# EAGLE design mic4830_proto (EAGLE 5.11)
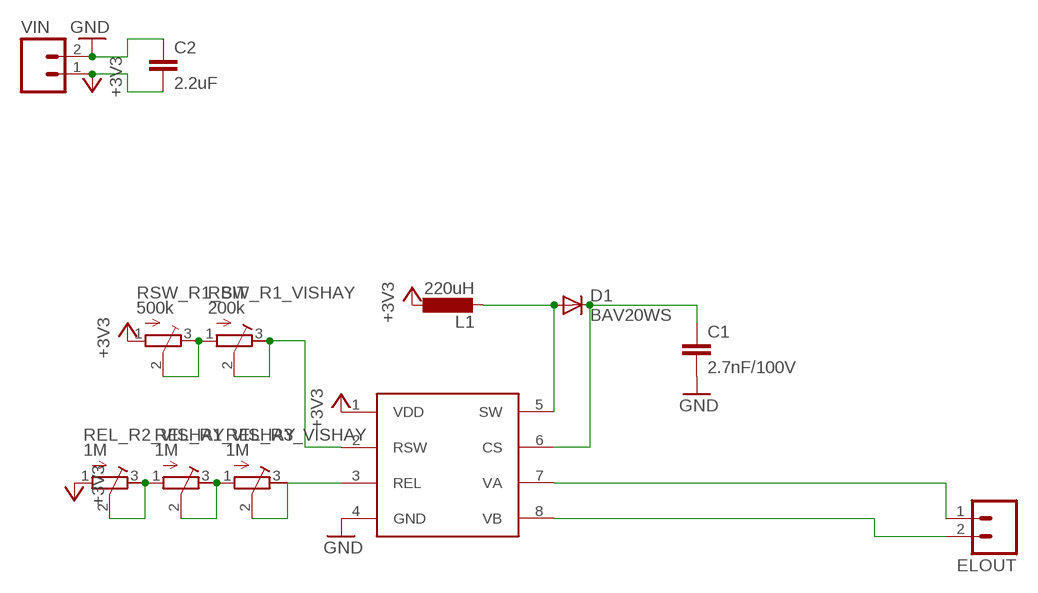
[diagram p0: schematic, sheet 1]

## Parts
C1  2.7nF/100V  C-EUC1210  [C1210]
C2  2.2uF  C-EUC0805K  [C0805K]
D1  BAV20WS  DIODESOD  [SOD-323]
ELOUT  M02PTH  [1X02]
L1  220uH  L-EUL1812  [L1812]
REL_R1_VISHAY  1M  R-TRIMMTSM53YL  [RTRIMTSM53YL]
REL_R2_VISHAY  1M  R-TRIMMTSM53YL  [RTRIMTSM53YL]
REL_R3_VISHAY  1M  R-TRIMMTSM53YL  [RTRIMTSM53YL]
RSW_R1_BIT  500k  TRIM_EU-SM-42/43W  [SM-42/43W]
RSW_R1_VISHAY  200k  R-TRIMMTSM53YL  [RTRIMTSM53YL]
U$1  MIC4830  [MSOP8]
VIN  M02PTH  [1X02]

## Nets
+3V3: C2.2 L1.1 REL_R2_VISHAY.1(E) RSW_R1_BIT.1(A) U$1.1(VDD) VIN.1
GND: C1.2 C2.1 U$1.4(GND) VIN.2
N$1: ELOUT.2 U$1.8(VB)
N$2: ELOUT.1 U$1.7(VA)
N$3: D1.2(A) L1.2 U$1.5(SW)
N$4: C1.1 D1.1(C) U$1.6(CS)
N$5: RSW_R1_BIT.2(S) RSW_R1_BIT.3(E) RSW_R1_VISHAY.1(E)
N$6: RSW_R1_VISHAY.2(S) RSW_R1_VISHAY.3(A) U$1.2(RSW)
N$7: REL_R1_VISHAY.2(S) REL_R1_VISHAY.3(A) REL_R3_VISHAY.1(E)
N$9: REL_R3_VISHAY.2(S) REL_R3_VISHAY.3(A) U$1.3(REL)
REL_R2_VISHAY: REL_R1_VISHAY.1(E) REL_R2_VISHAY.2(S) REL_R2_VISHAY.3(A)

## Library data of the parts
C1 C2 = rcl:C-EU: CAPACITOR, European symbol
D1 = SparkFun:DIODE: Diode These are standard reverse protection diodes and small signal diodes. SMA package can handle up to about 1A. SOD-323 can handle about 200mA. What the SOD-323 package when ordering, there are some mfgs out there that are 5-pin packages.
ELOUT VIN = SparkFun:M02: Header 2 Standard 2-pin 0.1" header. Use with straight break away headers (SKU : PRT-00116), right angle break away headers (PRT-00553), swiss pins (PRT-00743), machine pins (PRT-00117), and female headers (PRT-00115). Molex polarized connector foot print use with SKU : PRT-08233 with associated crimp pins and housings.
L1 = rcl:L-EU: INDUCTOR, European symbol
REL_R1_VISHAY REL_R2_VISHAY REL_R3_VISHAY RSW_R1_VISHAY = resistor:R-TRIMM: Trimm resistor
RSW_R1_BIT = pot:TRIM_EU-: POTENTIOMETER
U$1 = mine:MIC4830: MIC2830 EL Driver in 8-pin MSOP package

## Board
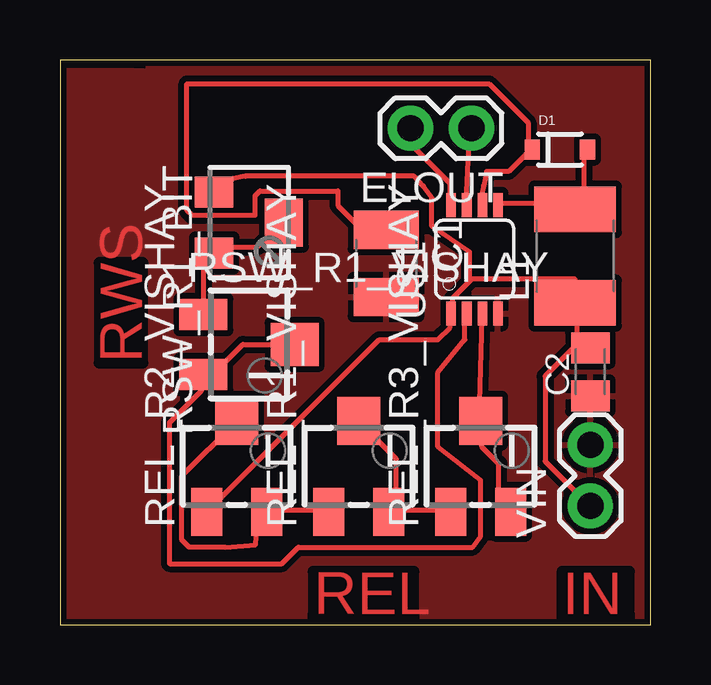
[diagram p1: board, top side]

Size 24.62 x 23.55 mm. Coordinates in mm from the lower left corner, seen from the top.
Outline: 0,0 24.62,0 24.62,23.55 0,23.55 0,0
Copper layers (1*16): Top 0.035mm / dielectric 1.5mm / Bottom 0.035mm
Design rules "ITead_rule *": minimum track width 8mil, minimum drill 12mil, track to track 8mil, track to pad 8mil, pad to pad 8mil, via to via 8mil, smd to smd 0mil, copper to edge 10mil, drill to drill 10mil, minimum pad ring 10mil, minimum via ring 6mil, stop-mask expansion 2mil, vias tented up to drill 100mil, thermal gap 10mil

### Footprints (pad centres in the part's own frame; a part is rotated, then mirrored left to right if it is on the bottom)
C1210 = smd 1.6 x 2.7: 1 -1.4,0; 2 1.4,0
C0805K = smd 1.3 x 1.6: 1 -1,0; 2 1,0
SOD-323 = smd 0.63 x 0.83: 1 -1.15,0; 2 1.15,0
1X02 = drill 1.1 pad 1.88 round: 1 0,0; 2 2.54,0
L1812 = smd 1.9 x 3.4: 1 -1.95,0; 2 1.95,0
RTRIMTSM53YL = smd 1.3 x 2: 1 -1.25,-1.9; 3 1.25,-1.9 | smd 1.8 x 2: 2 0,1.9
SM-42/43W = smd 1.3 x 1.6: 1 -1.27,-1.45; 3 1.27,-1.45 | smd 2 x 1.6: 2 0,1.45
MSOP8 = smd 0.4 x 1: 1 1.564,0.277; 2 2.214,0.277; 3 2.864,0.277; 4 3.514,0.277; 5 3.514,4.802; 6 2.864,4.802; 7 2.214,4.802; 8 1.564,4.802

### Placement (x,y rotation side)
C1  13.59,15.06 270 top
C2  22.1,10.54 90 top
D1  20.83,19.81 0 top
ELOUT  17.14,20.7 180 top
L1  21.46,15.37 90 top
REL_R1_VISHAY  12.45,6.6 0 top
REL_R2_VISHAY  7.37,6.6 0 top
REL_R3_VISHAY  17.53,6.6 0 top
RSW_R1_BIT  7.87,16.76 270 top
RSW_R1_VISHAY  7.87,11.68 270 top
U$1  14.73,12.7 0 top
VIN  22.1,4.95 90 top

### Tracks (layer width: path | path; a pad name or v marks a point on that pad's centre or on a via)
+3V3
  Top 0.203: 17.12,14.38 17.17,14.43 21.44,14.43 21.44,13.51 L1.1 21.54,13.41 21.54,12.09 22.05,11.58 C2.2 21.64,11.89 21.64,11.79 20.22,10.36 20.22,6.81 22.05,4.98 VIN.1 | 17.12,14.38 16.36,13.61 16.36,13.01 U$1.1 16.26,12.9 16.26,12.39 15.75,11.89 13.31,11.89 6.2,4.78 REL_R2_VISHAY.1 | RSW_R1_BIT.1 6.5,18.09 7.21,18.59 7.72,18.69 14.76,18.69 15.14,18.29 15.49,17.8 15.49,16.61 17.07,15.54 17.07,14.43 17.12,14.38
GND
  pour Top (isolate 0.254): 18.41,22.99 18.67,16.76 18.8,0 0,0 0,23.11
  pour Top (isolate 0.254): 14.1,23.24 14.1,0.13 24.51,0.13 24.51,13.46 20.07,13.46 20.07,17.4 24.64,17.4 24.64,23.24
  pour Top (isolate 0.254): 22.73,11.81 24.64,11.81 24.64,23.5 3.68,23.5 3.68,11.3 19.68,11.3 19.68,16.89 23.24,16.89 23.24,12.57 22.73,12.57
N$1
  Top 0.203: U$1.8 16.26,17.58 16.26,18.39 14.63,20.02 14.63,20.62 ELOUT.2
N$2
  Top 0.203: U$1.7 16.97,17.58 16.94,18.06 17.07,20.62 ELOUT.1
N$3
  Top 0.203: D1.2 21.95,19.81 21.84,19.71 21.84,17.68 21.54,17.37 L1.2 21.64,17.58 18.29,17.58 U$1.5
N$4
  Top 0.203: U$1.6 17.58,17.58 17.58,17.98 17.65,18.31 17.78,18.9 18.69,18.9 19.61,19.81 D1.1 19.51,19.81 19.51,20.93 17.88,22.55 5.28,22.55 5.28,17.27 5.49,17.07 8.13,17.07 8.13,17.88 8.33,18.09 11.58,18.09 11.58,17.48 12.7,16.36 13.51,16.36 13.51,16.46 C1.1
N$5
  Top 0.203: RSW_R1_VISHAY.1 5.99,13.01 5.99,15.04 6.4,15.44 RSW_R1_BIT.3 6.5,15.54 6.5,15.75 8.23,15.75 9.25,16.76 RSW_R1_BIT.2
N$6
  Top 0.203: 5.89,9.96 5.89,10.36 RSW_R1_VISHAY.3 5.89,9.96 | 5.89,9.96 5.89,9.75 4.57,8.43 4.57,2.54 9.25,2.54 9.93,3.23 17.2,3.23 17.53,3.68 17.53,6.02 15.75,7.42 15.75,10.52 16.87,11.89 16.87,12.9 U$1.2 | 5.89,9.96 7.62,11.68 RSW_R1_VISHAY.2
N$7
  Top 0.203: 14.02,4.78 16.26,4.78 REL_R3_VISHAY.1 | 14.02,4.78 13.72,4.78 REL_R1_VISHAY.3 14.02,4.78 | 14.02,4.78 14.02,6.91 12.5,8.43 REL_R1_VISHAY.2
N$9
  Top 0.203: U$1.3 17.58,12.9 17.6,12.8 17.48,8.53 REL_R3_VISHAY.2 17.58,8.43 17.58,7.42 18.29,6.71 18.29,5.18 18.69,4.78 REL_R3_VISHAY.3
REL_R2_VISHAY
  Top 0.203: REL_R1_VISHAY.1 11.18,4.78 8.64,4.78 REL_R2_VISHAY.3 8.53,4.67 8.23,4.67 8.15,3.33 6.88,3.23 5.38,3.23 5.08,3.53 5.08,6.2 7.32,8.43 REL_R2_VISHAY.2

### Text on the board
Top: RWS | REL | IN